# Altium project UC-453.PrjPCB
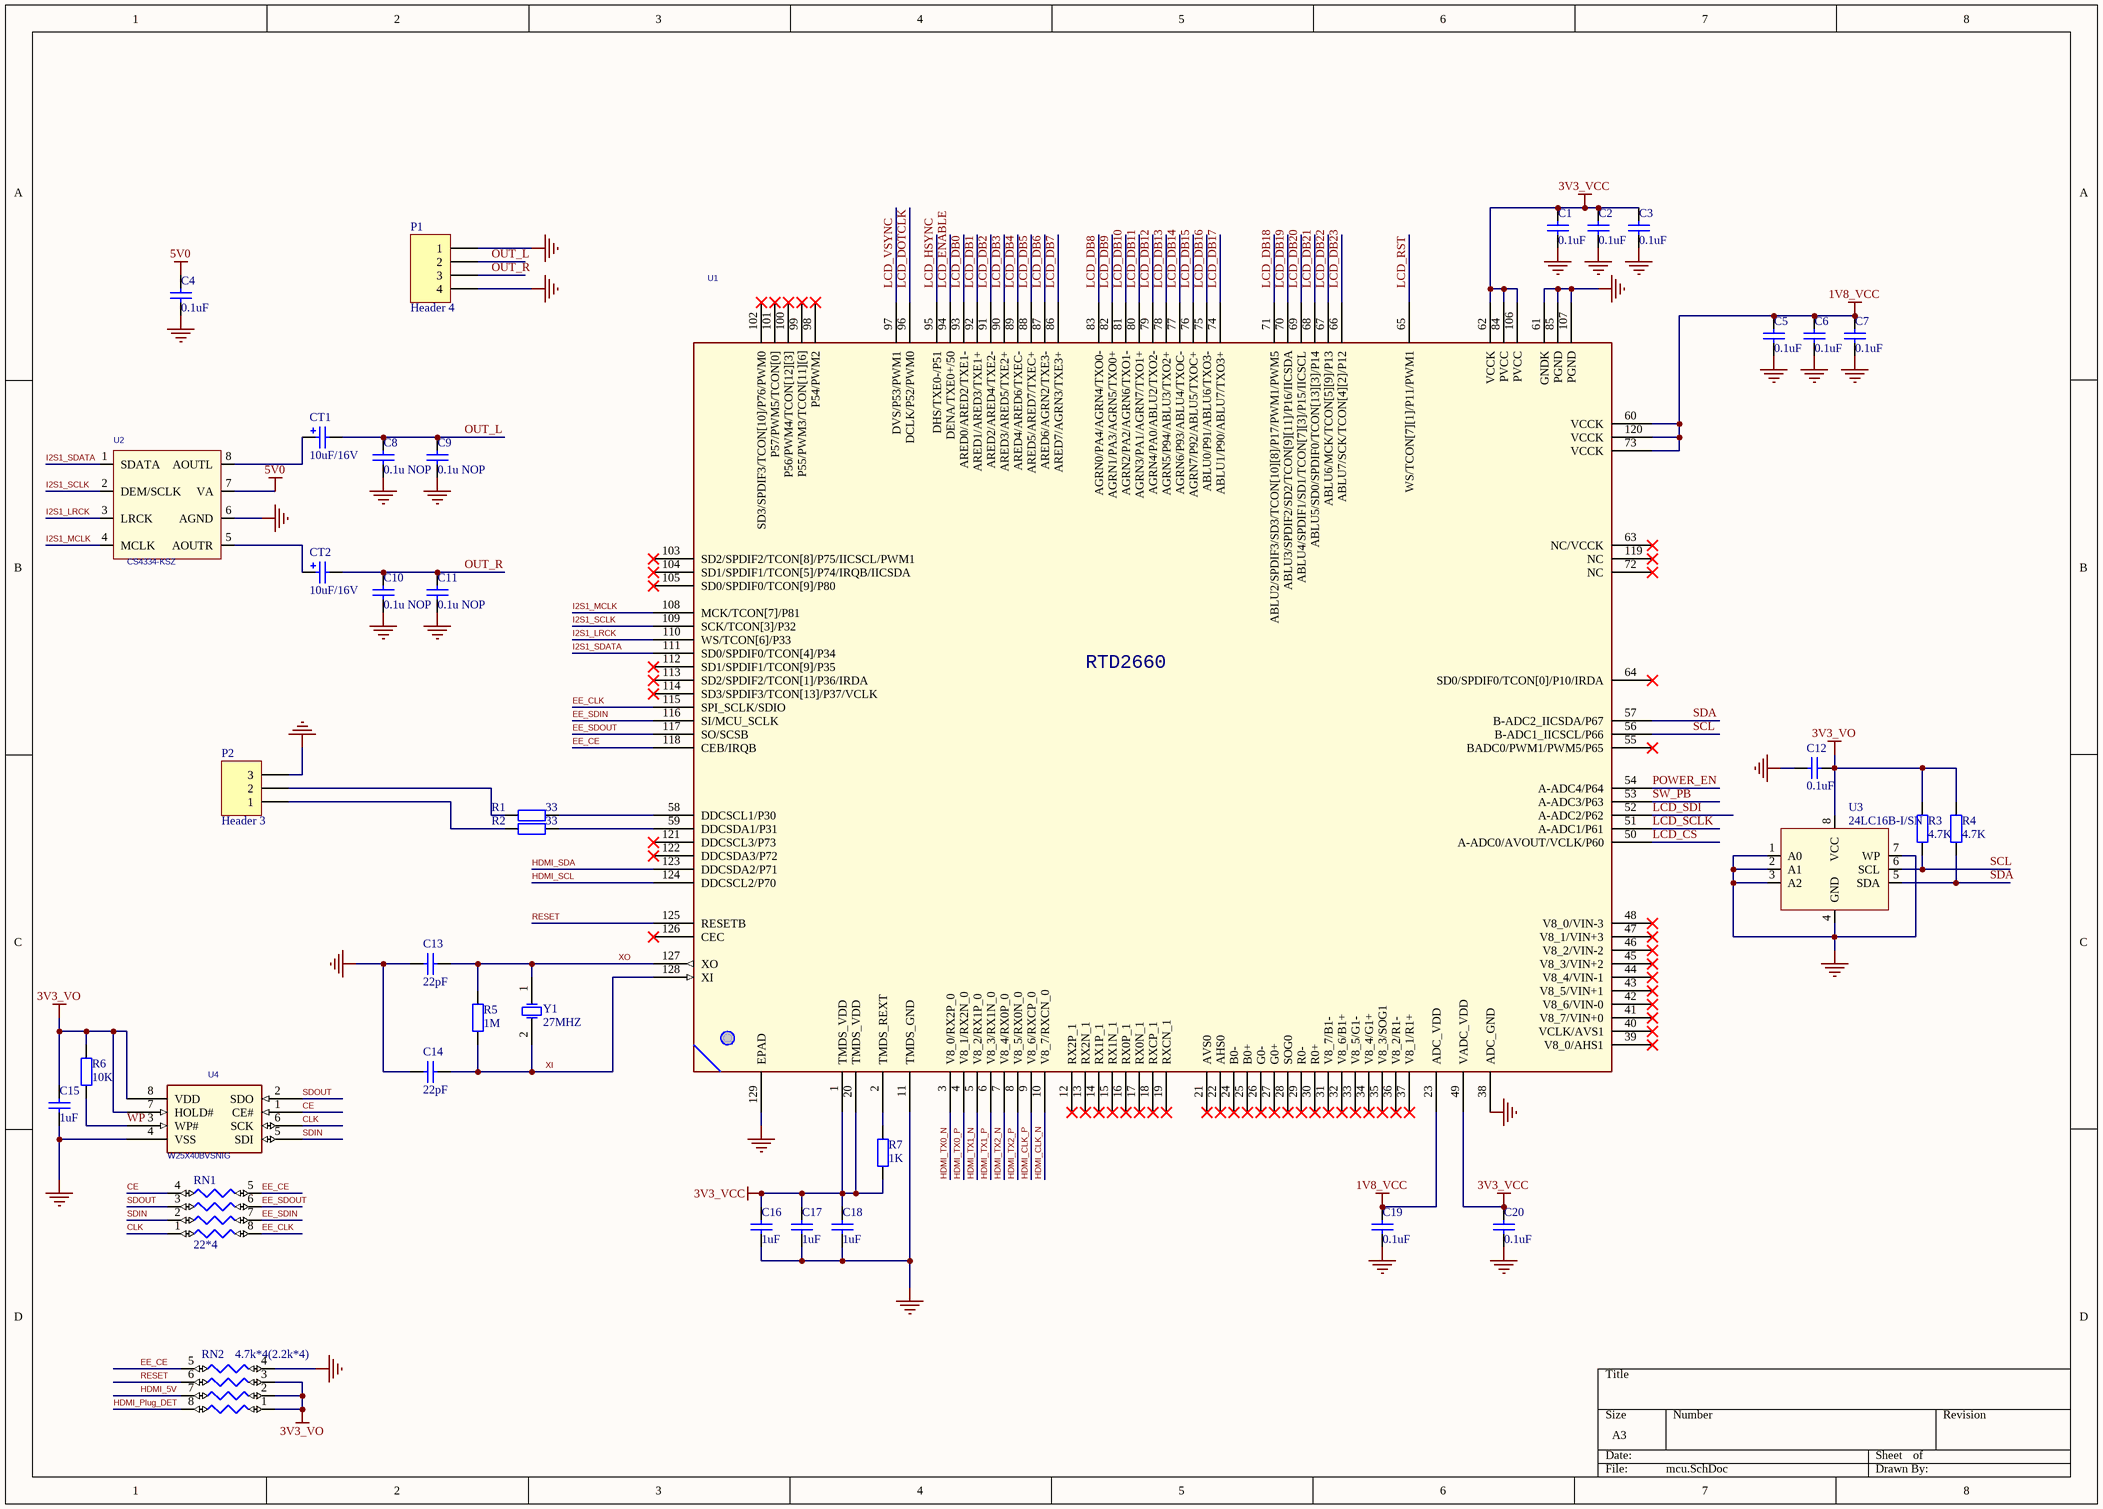
[diagram p0: mcu.SchDoc]
2 sheets, 73 parts. Net scope: global (net labels, ports and power ports of the same name join across sheets).
Board file: UC-453.PcbDoc
Sheets:
  mcu.SchDoc
  power.SchDoc

## Sheet mcu.SchDoc
size A3

### Parts
C1  0.1uF  [0603S-CAP]
C2  0.1uF  [0603S-CAP]
C3  0.1uF  [0603S-CAP]
C4  0.1uF  [0603S-CAP]
C5  0.1uF  [0603S-CAP]
C6  0.1uF  [0603S-CAP]
C7  0.1uF  [0603S-CAP]
C8  0.1u NOP  [0603S-CAP]
C9  0.1u NOP  [0603S-CAP]
C10  0.1u NOP  [0603S-CAP]
C11  0.1u NOP  [0603S-CAP]
C12  0.1uF  [0603S-CAP]
C13  22pF  [0603S-CAP]
C14  22pF  [0603S-CAP]
C15  1uF  [0603S-CAP]
C16  1uF  [0603S-CAP]
C17  1uF  [0603S-CAP]
C18  1uF  [0603S-CAP]
C19  0.1uF  [0603S-CAP]
C20  0.1uF  [0603S-CAP]
CT1  10uF/16V  [钽电容（A型）]
CT2  10uF/16V  [钽电容（A型）]
P1  Header 4  [PJ-342]
P2  Header 3  [smt1X3]
R1  33  [0603S-RES]
R2  33  [0603S-RES]
R3  4.7K  [0603S-RES]
R4  4.7K  [0603S-RES]
R5  1M  [0603S-RES]
R6  10K  [0603S-RES]
R7  1K  [0603S-RES]
RN1  22*4  [NC06-4]
RN2  4.7k*4(2.2k*4)  [NC06-4]
U1  RTD2660H  [LQFP128_P0_5_22X16_EPAD]  (value not drawn)
U2  CS4334-KSZ  [SOIC-8N]
U3  24LC16B-I/SN  [SOIC-8N]
U4  W25X40BVSNIG  [SOIC-8N]
Y1  27MHZ  [XTAL-SMT]

### Nets
1V8_VCC: C5.2 C6.2 C7.2 C19.2 U1.23(ADC_VDD) U1.60(VCCK) U1.73(VCCK) U1.120(VCCK)
3V3_VCC: C1.2 C2.2 C3.2 C16.2 C17.2 C18.2 C20.2 R7.1 U1.1(TMDS_VDD) U1.20(TMDS_VDD) U1.49(VADC_VDD) U1.62(VCCK) U1.84(PVCC) U1.106(PVCC)
3V3_VO: C12.2 C15.2 R3.2 R4.2 R6.2 RN2.1 RN2.2 RN2.3 U3.8(VCC) U4.7(HOLD#) U4.8(VDD)
5V0: C4.2 U2.7(VA)
GND: C1.1 C2.1 C3.1 C4.1 C5.1 C6.1 C7.1 C8.1 C9.1 C10.1 C11.1 C12.1 C13.2 C14.2 C15.1 C16.1 C17.1 C18.1 C19.1 C20.1 P1.1 P1.4 P2.3 RN2.4 U1.11(TMDS_GND) U1.38(ADC_GND) U1.61(GNDK) U1.85(PGND) U1.107(PGND) U1.129(EPAD) U2.6(AGND) U3.1(A0) U3.2(A1) U3.3(A2) U3.4(GND) U3.7(WP) U4.4(VSS)
CE: RN1.4 U4.1(CE#)
CLK: RN1.1 U4.6(SCK)
EE_CE: RN1.5 RN2.5 U1.118(CEB/IRQB)
EE_CLK: RN1.8 U1.115(SPI_SCLK/SDIO)
EE_SDIN: RN1.7 U1.116(SI/MCU_SCLK)
EE_SDOUT: RN1.6 U1.117(SO/SCSB)
HDMI_5V: RN2.7
HDMI_CLK_N: U1.10(V8_7/RXCN_0)
HDMI_CLK_P: U1.9(V8_6/RXCP_0)
HDMI_Plug_DET: RN2.8
HDMI_SCL: U1.124(DDCSCL2/P70)
HDMI_SDA: U1.123(DDCSDA2/P71)
HDMI_TX0_N: U1.3(V8_0/RX2P_0)
HDMI_TX0_P: U1.4(V8_1/RX2N_0)
HDMI_TX1_N: U1.5(V8_2/RX1P_0)
HDMI_TX1_P: U1.6(V8_3/RX1N_0)
HDMI_TX2_N: U1.7(V8_4/RX0P_0)
HDMI_TX2_P: U1.8(V8_5/RX0N_0)
I2S1_LRCK: U1.110(WS/TCON[6]/P33) U2.3(LRCK)
I2S1_MCLK: U1.108(MCK/TCON[7]/P81) U2.4(MCLK)
I2S1_SCLK: U1.109(SCK/TCON[3]/P32) U2.2(DEM/SCLK)
I2S1_SDATA: U1.111(SD0/SPDIF0/TCON[4]/P34) U2.1(SDATA)
LCD_CS: U1.50(A-ADC0/AVOUT/VCLK/P60)
LCD_DB0: U1.93(ARED0/ARED2/TXE1-)
LCD_DB1: U1.92(ARED1/ARED3/TXE1+)
LCD_DB2: U1.91(ARED2/ARED4/TXE2-)
LCD_DB3: U1.90(ARED3/ARED5/TXE2+)
LCD_DB4: U1.89(ARED4/ARED6/TXEC-)
LCD_DB5: U1.88(ARED5/ARED7/TXEC+)
LCD_DB6: U1.87(ARED6/AGRN2/TXE3-)
LCD_DB7: U1.86(ARED7/AGRN3/TXE3+)
LCD_DB8: U1.83(AGRN0/PA4/AGRN4/TXO0-)
LCD_DB9: U1.82(AGRN1/PA3/AGRN5/TXO0+)
LCD_DB10: U1.81(AGRN2/PA2/AGRN6/TXO1-)
LCD_DB11: U1.80(AGRN3/PA1/AGRN7/TXO1+)
LCD_DB12: U1.79(AGRN4/PA0/ABLU2/TXO2-)
LCD_DB13: U1.78(AGRN5/P94/ABLU3/TXO2+)
LCD_DB14: U1.77(AGRN6/P93/ABLU4/TXOC-)
LCD_DB15: U1.76(AGRN7/P92/ABLU5/TXOC+)
LCD_DB16: U1.75(ABLU0/P91/ABLU6/TXO3-)
LCD_DB17: U1.74(ABLU1/P90/ABLU7/TXO3+)
LCD_DB18: U1.71(ABLU2/SPDIF3/SD3/TCON[10][8]/P17/PWM1/PWM5)
LCD_DB19: U1.70(ABLU3/SPDIF2/SD2/TCON[9][11]/P16/IICSDA)
LCD_DB20: U1.69(ABLU4/SPDIF1/SD1/TCON[7][3]/P15/IICSCL)
LCD_DB21: U1.68(ABLU5/SD0/SPDIF0/TCON[13][3]/P14)
LCD_DB22: U1.67(ABLU6/MCK/TCON[5][9]/P13)
LCD_DB23: U1.66(ABLU7/SCK/TCON[4][2]/P12)
LCD_DOTCLK: U1.96(DCLK/P52/PWM0)
LCD_ENABLE: U1.94(DENA/TXE0+/50)
LCD_HSYNC: U1.95(DHS/TXE0-/P51)
LCD_RST: U1.65(WS/TCON[7][1]/P11/PWM1)
LCD_SCLK: U1.51(A-ADC1/P61)
LCD_SDI: U1.52(A-ADC2/P62)
LCD_VSYNC: U1.97(DVS/P53/PWM1)
OUT_L: C8.2 C9.2 CT1.2 P1.2
OUT_R: C10.2 C11.2 CT2.2 P1.3
POWER_EN: U1.54(A-ADC4/P64)
RESET: RN2.6 U1.125(RESETB)
SCL: R3.1 U1.56(B-ADC1_IICSCL/P66) U3.6(SCL)
SDA: R4.1 U1.57(B-ADC2_IICSDA/P67) U3.5(SDA)
SDIN: RN1.2 U4.5(SDI)
SDOUT: RN1.3 U4.2(SDO)
SW_PB: U1.53(A-ADC3/P63)
WP: R6.1 U4.3(WP#)
XI: C14.1 R5.1 U1.128(XI) Y1.2(OSC2)
XO: C13.1 R5.2 U1.127(XO) Y1.1(OSC1)
NetCT1_1: CT1.1 U2.8(AOUTL)
NetCT2_1: CT2.1 U2.5(AOUTR)
NetP2_1: P2.1 R2.2
NetP2_2: P2.2 R1.2
NetR1_1: R1.1 U1.58(DDCSCL1/P30)
NetR2_1: R2.1 U1.59(DDCSDA1/P31)
NetR7_2: R7.2 U1.2(TMDS_REXT)

Not connected (* = marked no-connect by the designer): U1 12(RX2P_1)* 13(RX2N_1)* 14(RX1P_1)* 15(RX1N_1)* 16(RX0P_1)* 17(RX0N_1)* 18(RXCP_1)* 19(RXCN_1)* 21(AVS0)* 22(AHS0)* 24(B0-)* 25(B0+)* 26(G0-)* 27(G0+)* 28(SOG0)* 29(R0-)* 30(R0+)* 31(V8_7/B1-)* 32(V8_6/B1+)* 33(V8_5/G1-)* 34(V8_4/G1+)* 35(V8_3/SOG1)* 36(V8_2/R1-)* 37(V8_1/R1+)* 39(V8_0/AHS1)* 40(VCLK/AVS1)* 41(V8_7/VIN+0)* 42(V8_6/VIN-0)* 43(V8_5/VIN+1)* 44(V8_4/VIN-1)* 45(V8_3/VIN+2)* 46(V8_2/VIN-2)* 47(V8_1/VIN+3)* 48(V8_0/VIN-3)* 55(BADC0/PWM1/PWM5/P65)* 63(NC/VCCK)* 64(SD0/SPDIF0/TCON[0]/P10/IRDA)* 72(NC)* 98(P54/PWM2)* 99(P55/PWM3/TCON[11][6])* 100(P56/PWM4/TCON[12][3])* 101(P57/PWM5/TCON[0])* 102(SD3/SPDIF3/TCON[10]/P76/PWM0)* 103(SD2/SPDIF2/TCON[8]/P75/IICSCL/PWM1)* 104(SD1/SPDIF1/TCON[5]/P74/IRQB/IICSDA)* 105(SD0/SPDIF0/TCON[9]/P80)* 112(SD1/SPDIF1/TCON[9]/P35)* 113(SD2/SPDIF2/TCON[1]/P36/IRDA)* 114(SD3/SPDIF3/TCON[13]/P37/VCLK)* 119(NC)* 121(DDCSCL3/P73)* 122(DDCSDA3/P72)* 126(CEC)*

### Notes on the sheet
- (in symbol RTD2523_10) RTD2660

### Library data of the parts
C1-C11 C13-C20 = Cap: 50V/8.2u/0805; Value: 100n; Published: 8-Jun-2000; LatestRevisionDate: 17-Jul-2002; LatestRevisionNote: Re-released for DXP Platform.; PackageReference: RAD-0.3; Publisher: Altium Limited
C12 = CAP SMT 0.1uF 16V X7R: 2. Manufacturere Part Number: C0805C104K4RACTU; 1. Manufacturer: Kemet; 8. Alternate Part: any; 7. Package / Case: 0805; 6. Mounting Type: SMT; 5. Supplier Link: http://www.digikey.com/product-detail/en/C0805C104K4RACTU/399-1167-1-ND/411442; 3. Supplier: Digi-Key; 4. Supplier Part Number: 399-1167-1-ND
CT1 CT2 = Cap Pol2: Polarized Capacitor (Axial); Value: 100pF; Published: 8-Jun-2000; LatestRevisionDate: 17-Jul-2002; LatestRevisionNote: Re-released for DXP Platform.; PackageReference: POLAR0.8; Publisher: Altium Limited
P1 = Header 4: Header, 4-Pin; LatestRevisionDate: 17-Jul-2002; LatestRevisionNote: Re-released for DXP Platform.; Publisher: Altium Limited
P2 = Header 3: Header, 3-Pin; LatestRevisionDate: 17-Jul-2002; LatestRevisionNote: Re-released for DXP Platform.; Publisher: Altium Limited
R1 R2 R5-R7 = Res2: Resistor; Value: 49.9; Published: 8-Jun-2000; LatestRevisionDate: 17-Jul-2002; LatestRevisionNote: Re-released for DXP Platform.; PackageReference: AXIAL-0.4; Publisher: Altium Limited
R3 R4 = Res2: Resistor; Value: 10K; Published: 8-Jun-2000; LatestRevisionDate: 17-Jul-2002; LatestRevisionNote: Re-released for DXP Platform.; PackageReference: AXIAL-0.4; Publisher: Altium Limited
RN1 RN2 = RN4: Option 2 - Device: *; Option 2 - Spec: *; Option 3 - Device: *; Option 3 - Spec: *; Option 4 - Device: *; Option 4 - Spec: *; Option 5 - Device: *; Option 5 - Spec: *; Option 6 - Device: *; Option 6 - Spec: *; Option 7 - Device: *; Option 7 - Spec: *; Option 8 - Device: *; Option 8 - Spec: *
U1 = RTD2523_10: Part Number: 21-D004978
U2 = CS4334-KSZ: Part Number: 19-D005021
U3 = 24LC64-I/SN: IC EEPROM 64KBIT 400KHZ 8SOIC; Manufacturer: Microchip Technology; Format - Memory: EEPROMs - Serial; Memory Size: 64K (8K x 8); Interface: I2C, 2-Wire Serial; Voltage - Supply: 2.5 V ~ 5.5 V; Supplier 1: Digi-Key; Manufacturer Part Number: 24LC64-I/SN; RoHS: RoHS Compliant; Category: Integrated Circuits (ICs); Stock 1: 16323; Pricing 1: 1=0.38, 25=0.37, 100=0.35 (USD); Packaging: Tube; Memory Type: EEPROM; Speed: 400kHz; Operating Temperature: -40°C ~ 85°C (TA); Package / Case: 8-SOIC (0.154", 3.90mm Width); Supplier Device Package: 8-SOIC; ComponentLink1URL: http://www.microchip.com/mymicrochip/filehandler.aspx?ddocname=en011843; ComponentLink1Description: http://www.microchip.com/mymicrochip/filehandler.aspx?ddocname=en011843; Supplier Part Number 1: 24LC64-I/SN-ND
U4 = 24C08_1: part number: 19-D004782
Y1 = XTAL 32.768KHZ: Crystal, CRYSTAL 32.768KHZ 6PF SMD; 2. Manufacturere Part Number: ABS07-120-32.768KHZ-T; 1. Manufacturer: Abracon; 6. Mounting Type: SMT; 9. Notes: 2 pad - Abracon ABS07-120-32.768KHZ-T, 4 pad - Abracon ABS25-32.768KHZ-6-T; 0. Do Not Install: DNI; 5. Supplier Link: http://www.digikey.com/product-detail/en/ABS07-120-32.768KHZ-T/535-11937-1-ND/3724046; 3. Supplier: Digi-Key; 4. Supplier Part Number: 535-11937-1-ND

## Sheet power.SchDoc
size A4
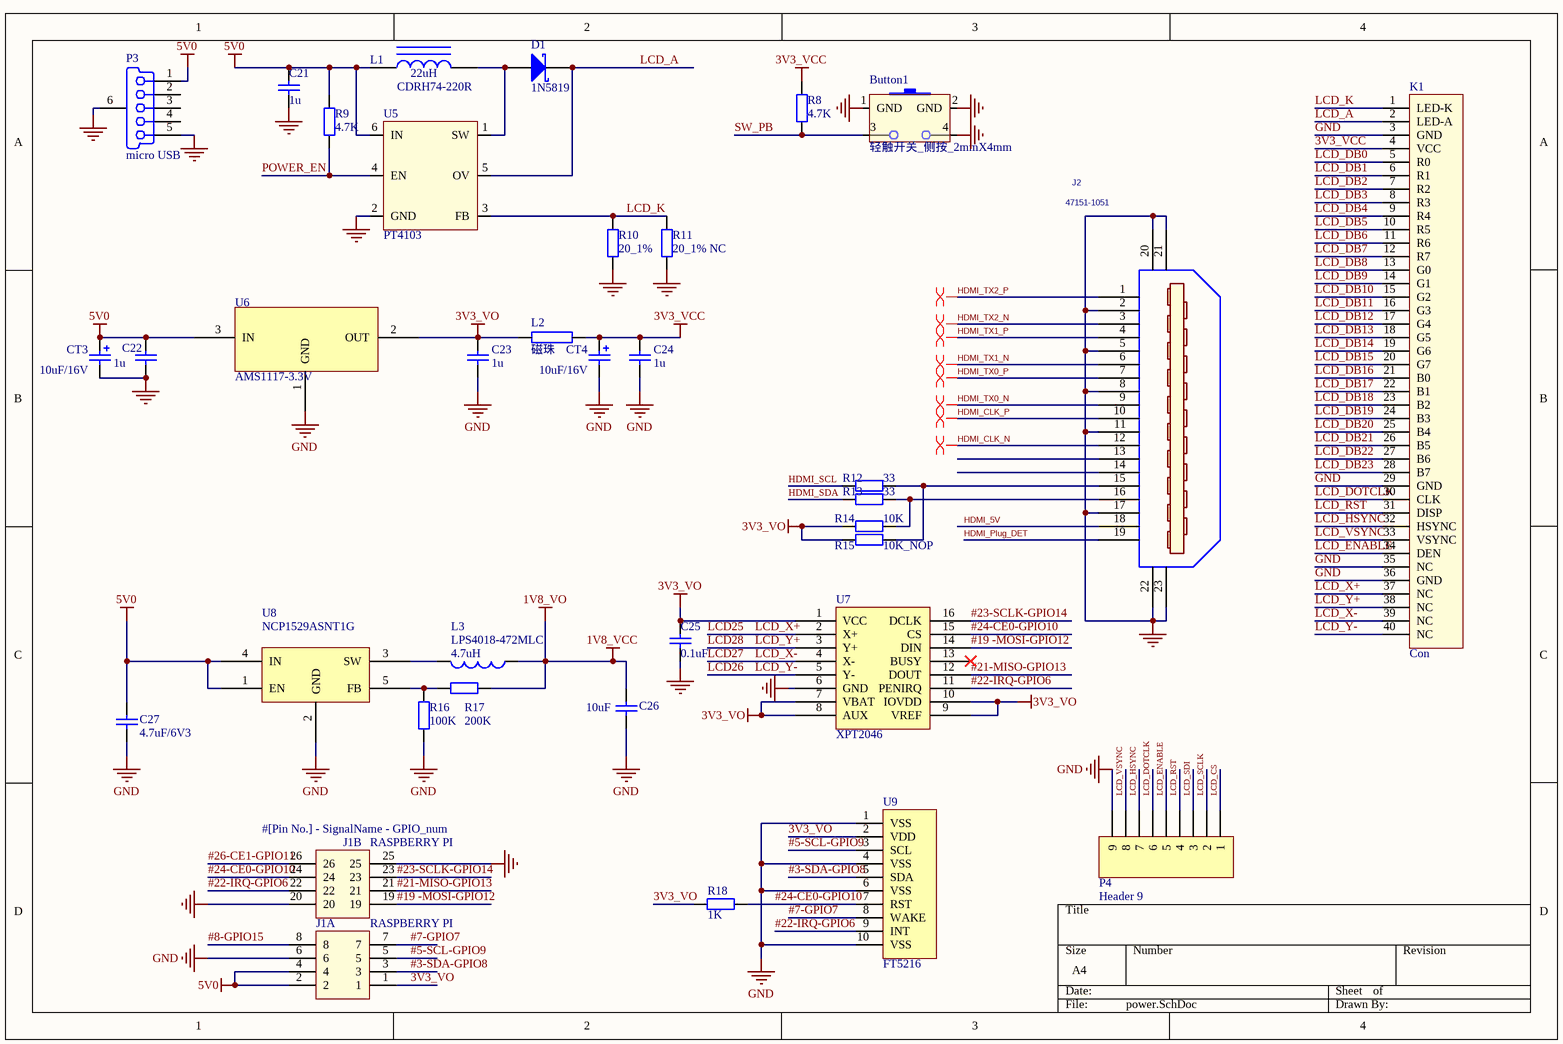
[diagram p1: power.SchDoc]

### Parts
Button1  轻触开关_侧按_2mmX4mm  [轻触开关_侧按_2mmX4mm]
C21  1u  [0603S-CAP]
C22  1u  [0603S-CAP]
C23  1u  [0603S-CAP]
C24  1u  [0603S-CAP]
C25  0.1uF  [0603S-CAP]
C26  10uF  [0603S-CAP]
C27  4.7uF/6V3  [0603S-CAP]
CT3  10uF/16V  [钽电容（A型）]
CT4  10uF/16V  [钽电容（A型）]
D1  1N5819  [SMA]
J1  RASPBERRY PI  [HDR2X20]  (parts A,B of 2)
J2  47151-1051  [47151-1051]
K1  Con  [ER-TFT028-4 -B]
L1  CDRH74-220R  [CDRH74-220R 7*7*4]
L2  磁珠  [L0603]
L3  LPS4018-472MLC  value 4.7uH  [LVF404015N]
P3  micro USB  [FCI_10118194-0001]
P4  Header 9  [HDR1X9]
R8  4.7K  [0603S-RES]
R9  4.7K  [0603S-RES]
R10  20_1%  [0603S-RES]
R11  20_1% NC  [0603S-RES]
R12  33  [0603S-RES]
R13  33  [0603S-RES]
R14  10K  [0603S-RES]
R15  10K_NOP  [0603S-RES]
R16  100K  [0603S-RES]
R17  200K  [0603S-RES]
R18  1K  [0603S-RES]
U5  PT4103  [SOT23-6N]
U6  AMS1117-3.3V  [SOT-223]
U7  XPT2046  [ADS7843]
U8  NCP1529ASNT1G  [SOT23-5]
U9  FT5216  [FT5216]

### Nets
1V8_VCC: C26.1 L3.1 R17.1  [also labelled 1V8_VO]
3V3_VCC: C24.2 CT4.1 K1.4(VCC) L2.1 R8.2
3V3_VO: C23.2 C25.2 J1.1 L2.2 R14.2 R15.2 R18.1 U6.2(OUT) U7.1(VCC) U7.7(VBAT) U7.8(AUX) U7.9(VREF) U7.10(IOVDD) U9.2(VDD)
5V0: C21.2 C22.2 C27.1 CT3.1 J1.2 J1.4 L1.1 P3.1(V_BUS_(5V)) R9.2 U5.6(IN) U6.3(IN) U8.1(EN) U8.4(IN)
GND: Button1.1(GND) Button1.2(GND) Button1.4 C21.1 C22.1 C23.1 C24.1 C25.1 C26.2 C27.2 CT3.2 CT4.2 J1.6 J1.20 J1.25 J2.2(P2) J2.5(P5) J2.8(P8) J2.11(P11) J2.17(P17) J2.20(SH1) J2.21(SH2) J2.22(SH3) J2.23(SH4) K1.3(GND) K1.29(GND) K1.35(NC) K1.36(GND) P3.5(GND) P3.6(Tab) P4.9 R10.2 R11.2 R16.1 U5.2(GND) U6.1(GND) U7.6(GND) U8.2(GND) U9.1(VSS) U9.4(VSS) U9.6(VSS) U9.10(VSS)
#3-SDA-GPIO8: J1.3 U9.5(SDA)
#5-SCL-GPIO9: J1.5 U9.3(SCL)
#7-GPIO7: J1.7 U9.8(WAKE)
#8-GPIO15: J1.8
#19 -MOSI-GPIO12: J1.19 U7.14(DIN)
#21-MISO-GPIO13: J1.21 U7.12(DOUT)
#22-IRQ-GPIO6: J1.22 U7.11(PENIRQ) U9.9(INT)
#23-SCLK-GPIO14: J1.23 U7.16(DCLK)
#24-CE0-GPIO10: J1.24 R18.2 U7.15(CS) U9.7(RST)
#26-CE1-GPIO11: J1.26
HDMI_5V: J2.18(P18)
HDMI_CLK_N: J2.12(P12)
HDMI_CLK_P: J2.10(P10)
HDMI_Plug_DET: J2.19(P19)
HDMI_SCL: R12.2
HDMI_SDA: R13.2
HDMI_TX0_N: J2.9(P9)
HDMI_TX0_P: J2.7(P7)
HDMI_TX1_N: J2.6(P6)
HDMI_TX1_P: J2.4(P4)
HDMI_TX2_N: J2.3(P3)
HDMI_TX2_P: J2.1(P1)
LCD25: K1.37(NC) U7.2(X+)  [also labelled LCD_X+]
LCD26: K1.40(NC) U7.5(Y-)  [also labelled LCD_Y-]
LCD27: K1.39(NC) U7.4(X-)  [also labelled LCD_X-]
LCD28: K1.38(NC) U7.3(Y+)  [also labelled LCD_Y+]
LCD_A: D1.K K1.2(LED-A) U5.5(OV)
LCD_CS: P4.1
LCD_DB0: K1.5(R0)
LCD_DB1: K1.6(R1)
LCD_DB2: K1.7(R2)
LCD_DB3: K1.8(R3)
LCD_DB4: K1.9(R4)
LCD_DB5: K1.10(R5)
LCD_DB6: K1.11(R6)
LCD_DB7: K1.12(R7)
LCD_DB8: K1.13(G0)
LCD_DB9: K1.14(G1)
LCD_DB10: K1.15(G2)
LCD_DB11: K1.16(G3)
LCD_DB12: K1.17(G4)
LCD_DB13: K1.18(G5)
LCD_DB14: K1.19(G6)
LCD_DB15: K1.20(G7)
LCD_DB16: K1.21(B0)
LCD_DB17: K1.22(B1)
LCD_DB18: K1.23(B2)
LCD_DB19: K1.24(B3)
LCD_DB20: K1.25(B4)
LCD_DB21: K1.26(B5)
LCD_DB22: K1.27(B6)
LCD_DB23: K1.28(B7)
LCD_DOTCLK: K1.30(CLK) P4.6
LCD_ENABLE: K1.34(DEN) P4.5
LCD_HSYNC: K1.32(HSYNC) P4.7
LCD_K: K1.1(LED-K) R10.1 R11.1 U5.3(FB)
LCD_RST: K1.31(DISP) P4.4
LCD_SCLK: P4.2
LCD_SDI: P4.3
LCD_VSYNC: K1.33(VSYNC) P4.8
POWER_EN: R9.1 U5.4(EN)
SW_PB: Button1.3 R8.1
NetD1_A: D1.A L1.2 U5.1(SW)
NetJ2_15: J2.15(P15) R12.1 R15.1
NetJ2_16: J2.16(P16) R13.1 R14.1
NetL3_2: L3.2 U8.3(SW)
NetR16_2: R16.2 R17.2 U8.5(FB)

Not connected (* = marked no-connect by the designer): J2 13(P13) 14(P14); P3 2(D-) 3(D+) 4(NC); U7 13(BUSY)*

### Layout directives
differential pair: HDMI_CLK_N, HDMI_CLK_P, HDMI_TX0_N, HDMI_TX0_P, HDMI_TX1_N, HDMI_TX1_P, HDMI_TX2_N, HDMI_TX2_P

### Notes on the sheet
- (near J1) #[Pin No.] - SignalName - GPIO_num
- (in symbol Inductor) 22uH

### Library data of the parts
C21 C23-C25 = Cap: 50V/8.2u/0805; Value: 100n; Published: 8-Jun-2000; LatestRevisionDate: 17-Jul-2002; LatestRevisionNote: Re-released for DXP Platform.; PackageReference: RAD-0.3; Publisher: Altium Limited
C22 = Cap: Capacitor; Value: 0.1u; Published: 8-Jun-2000; LatestRevisionDate: 17-Jul-2002; LatestRevisionNote: Re-released for DXP Platform.; PackageReference: RAD-0.3; Publisher: Altium Limited
C26 C27 = Cap: Capacitor; Value: 100pF; Published: 8-Jun-2000; LatestRevisionDate: 17-Jul-2002; LatestRevisionNote: Re-released for DXP Platform.; PackageReference: RAD-0.3; Publisher: Altium Limited
CT3 CT4 = Cap Pol2: as CT1 on sheet mcu; Published: 8-Jun-2000; LatestRevisionDate: 17-Jul-2002; LatestRevisionNote: Re-released for DXP Platform.; PackageReference: POLAR0.8; Publisher: Altium Limited
D1 = Diode BAT17: Silicon RF Schottky Diode for Mixer Applications in the VHF/UHF Range; Note: Pin 2 is not connected and not drawn.; Published: 21-Mar-2003; LatestRevisionDate: 29-May-2009; LatestRevisionNote: IPC-7351 Footprint Added.; DatasheetVersion: Oct-1999; PackageVersion: Sep-2001; PackageReference: SOT-23; Publisher: Altium Limited; PackageDescription: 3-Pin SOT-23 Package 0.95 mm Pitch, 2.5 mm Lead Span; ComponentLink1Description: Manufacturer Link; ComponentLink1URL: http://www.infineon.com/; ComponentLink2Description: Datasheet; ComponentLink2URL: http://www.infineon.com/upload/Document/cmc_upload/documents/009/363/bat17series.pdf
J2 = CON_HDMI_RA: HDMI Con, RA, SMT with PTH lugs; Manufacturer: Molex; Manuf. Part No: 47151-1051
L1 = Inductor: Manufacturer: Vishay Dale; Manufacturer Part Number: IFSC1515AHER2R2M01; Inductance: 2.2µH; Tolerance: ?0%; Current Rating: 3A; Shielding: Shielded; DC Resistance (DCR): 45 mOhm Max; Frequency - Test: 100kHz; Supplier 1: Digi-Key; Supplier Part Number 1: 541-1404-1-ND; RoHS: RoHS Compliant; Category: Inductors, Coils, Chokes; Stock 1: 26507; Pricing 1: 1=0.51, 10=0.417, 100=0.3475, 500=0.278, 1000=0.2502 (USD); Packaging: Cut Tape (CT); Type: -; Material - Core: -; Current - Saturation: 3A; Q @ Freq: -; Frequency - Self Resonant: -; Operating Temperature: -55°C ~ 125°C; Mounting Type: Surface Mount; Package / Case: Non Standard; Size / Dimension: 0.150" L x 0.150" W (3.80mm x 3.80mm); Height - Seated (Max): 0.075" (1.90mm); Supplier Device Package: -; ComponentLink1URL: http://www.vishay.com/docs/34295/sc15ah01.pdf; ComponentLink1Description: http://www.vishay.com/docs/34295/sc15ah01.pdf
L2 = RES
L3 = Inductor: Code_IEC: 1005; Published: 8-Jun-2000; LatestRevisionDate: 29-May-2009; LatestRevisionNote: IPC-7351 Footprint Added.; PackageReference: 0402-A; Publisher: Altium Limited; PackageDescription: Chip Inductor; Code_JEITA: 0402
P3 = 0481900001: Connector Receptacle USB - micro AB 2.0 5 Position Through Hole, Vertical; Manufacturer: Wurth Electronics Inc
P4 = Header 9: Header, 9-Pin; LatestRevisionDate: 17-Jul-2002; LatestRevisionNote: Re-released for DXP Platform.; Publisher: Altium Limited
R8-R15 R18 = Res2: Resistor; Value: 49.9; Published: 8-Jun-2000; LatestRevisionDate: 17-Jul-2002; LatestRevisionNote: Re-released for DXP Platform.; PackageReference: AXIAL-0.4; Publisher: Altium Limited
R16 R17 = Res2: Resistor; Value: 10K; Published: 8-Jun-2000; LatestRevisionDate: 17-Jul-2002; LatestRevisionNote: Re-released for DXP Platform.; PackageReference: AXIAL-0.4; Publisher: Altium Limited
U6 = AMS1117
U7 = ADS7843

## Nets that join several sheets
1V8_VCC: mcu (8 pins), power (C26.1 L3.1 R17.1)
3V3_VCC: mcu (14 pins), power (5 pins)
3V3_VO: mcu (11 pins), power (14 pins)
5V0: mcu (C4.2 U2.7), power (13 pins)
GND: mcu (37 pins), power (42 pins)
HDMI_5V: mcu (RN2.7), power (J2.18)
HDMI_CLK_N: mcu (U1.10), power (J2.12)
HDMI_CLK_P: mcu (U1.9), power (J2.10)
HDMI_Plug_DET: mcu (RN2.8), power (J2.19)
HDMI_SCL: mcu (U1.124), power (R12.2)
HDMI_SDA: mcu (U1.123), power (R13.2)
HDMI_TX0_N: mcu (U1.3), power (J2.9)
HDMI_TX0_P: mcu (U1.4), power (J2.7)
HDMI_TX1_N: mcu (U1.5), power (J2.6)
HDMI_TX1_P: mcu (U1.6), power (J2.4)
HDMI_TX2_N: mcu (U1.7), power (J2.3)
HDMI_TX2_P: mcu (U1.8), power (J2.1)
LCD_CS: mcu (U1.50), power (P4.1)
LCD_DB0: mcu (U1.93), power (K1.5)
LCD_DB1: mcu (U1.92), power (K1.6)
LCD_DB2: mcu (U1.91), power (K1.7)
LCD_DB3: mcu (U1.90), power (K1.8)
LCD_DB4: mcu (U1.89), power (K1.9)
LCD_DB5: mcu (U1.88), power (K1.10)
LCD_DB6: mcu (U1.87), power (K1.11)
LCD_DB7: mcu (U1.86), power (K1.12)
LCD_DB8: mcu (U1.83), power (K1.13)
LCD_DB9: mcu (U1.82), power (K1.14)
LCD_DB10: mcu (U1.81), power (K1.15)
LCD_DB11: mcu (U1.80), power (K1.16)
LCD_DB12: mcu (U1.79), power (K1.17)
LCD_DB13: mcu (U1.78), power (K1.18)
LCD_DB14: mcu (U1.77), power (K1.19)
LCD_DB15: mcu (U1.76), power (K1.20)
LCD_DB16: mcu (U1.75), power (K1.21)
LCD_DB17: mcu (U1.74), power (K1.22)
LCD_DB18: mcu (U1.71), power (K1.23)
LCD_DB19: mcu (U1.70), power (K1.24)
LCD_DB20: mcu (U1.69), power (K1.25)
LCD_DB21: mcu (U1.68), power (K1.26)
LCD_DB22: mcu (U1.67), power (K1.27)
LCD_DB23: mcu (U1.66), power (K1.28)
LCD_DOTCLK: mcu (U1.96), power (K1.30 P4.6)
LCD_ENABLE: mcu (U1.94), power (K1.34 P4.5)
LCD_HSYNC: mcu (U1.95), power (K1.32 P4.7)
LCD_RST: mcu (U1.65), power (K1.31 P4.4)
LCD_SCLK: mcu (U1.51), power (P4.2)
LCD_SDI: mcu (U1.52), power (P4.3)
LCD_VSYNC: mcu (U1.97), power (K1.33 P4.8)
POWER_EN: mcu (U1.54), power (R9.1 U5.4)
SW_PB: mcu (U1.53), power (Button1.3 R8.1)